# Altium schematic sheet Greinke_Boost_Converter.SchDoc
size A; SheetNumber: 3; SheetTotal: 3
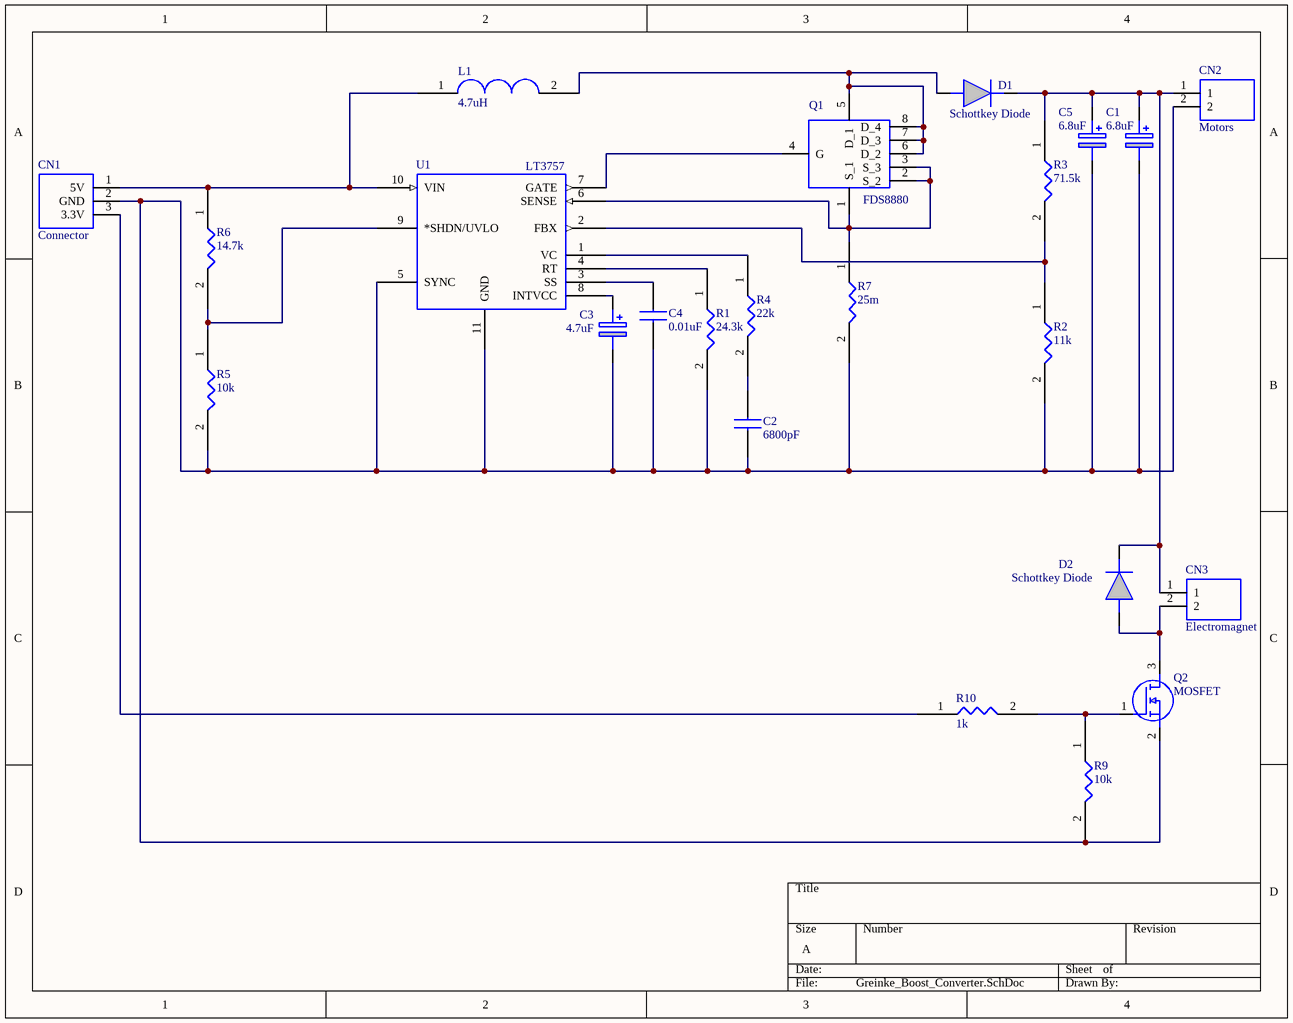
[diagram p0: Greinke_Boost_Converter.SchDoc]

## Parts
C1  6.8uF  [6.8u Capacitor]
C2  6800pF  [6800p Capacitor]
C3  4.7uF  [4.7u Capacitor]
C4  0.01uF  [0.01u Capacitor]
C5  6.8uF  [6.8u Capacitor]
CN1  Connector  [3 Terminal Blocks]
CN2  Motors  [2 Terminal Blocks]
CN3  Electromagnet  [2 Terminal Blocks]
D1  Schottkey Diode  [MBRS340]
D2  Schottkey Diode  [MBRS340]
L1  4.7uH  [4.7uH Inductor]
Q1  FDS8880  [FDS8880]
Q2  MOSFET  [Si2316DS]
R1  24.3k  [24.3k Resistor]
R2  11k  [11k Resistor]
R3  71.5k  [71.5k Resistor]
R4  22k  [22k Resistor]
R5  10k  [10k Resistor]
R6  14.7k  [14.7k Resistor]
R7  25m  [25m Resistor]
R9  10k  [10k Resistor]
R10  1k  [1k Resistor]
U1  LT3757  [LT3757]

## Nets
NetC1_1: C1.1(+) C5.1(+) CN2.1 CN3.1 D1.1(K) D2.1(K) R3.1
NetC1_2: C1.2(-) C2.2 C3.2(-) C4.1 C5.2(-) CN1.2(GND) CN2.2 Q2.2(S) R1.2 R2.2 R5.2 R7.2 R9.2 U1.5(SYNC) U1.11(GND)
NetC2_1: C2.1 R4.2
NetC3_1: C3.1(+) U1.8(INTVCC)
NetC4_2: C4.2 U1.3(SS)
NetCN1_1: CN1.1(5V) L1.1 R6.1 U1.10(VIN)
NetCN1_3: CN1.3(3.3V) R10.1
NetCN3_2: CN3.2 D2.2(A) Q2.3(D)
NetD1_2: D1.2(A) L1.2 Q1.5(D_1) Q1.6(D_2) Q1.7(D_3) Q1.8(D_4)
NetQ1_1: Q1.1(S_1) Q1.2(S_2) Q1.3(S_3) R7.1 U1.6(SENSE)
NetQ1_4: Q1.4(G) U1.7(GATE)
NetQ2_1: Q2.1(G) R9.1 R10.2
NetR1_1: R1.1 U1.4(RT)
NetR2_1: R2.1 R3.2 U1.2(FBX)
NetR4_1: R4.1 U1.1(VC)
NetR5_1: R5.1 R6.2 U1.9(*SHDN/UVLO)

## Library data of the parts
C1 C5 = 6.8u Capacitor
C2 = 6800p Capacitor
C3 = 4.7u Capacitor
C4 = 0.01u Capacitor_1
CN1 = 3 Terminal Blocks
CN2 CN3 = 2 Terminal Blocks
D1 D2 = MBRS340
L1 = 4.7uH Inductor
Q2 = Si2316DS
R1 = 24.3k Resistor
R2 = 11k Resistor
R3 = 71.5k Resistor
R4 = 22k Resistor
R5 R9 = 10k Resistor
R6 = 14.7k Resistor
R7 = 25m Resistor
R10 = 1k Resistor